# EasyEDA Pro project ProPrj_练手开发板_2024-08-21.epro, schematic t113_开发板

## Sheets
1 电源: Create Date: 2024-05-14; Page Name: 电源; Project Name: T113_开发板; Schematic Name: t113_开发板; Update Date: 2024-05-17; Company: 嘉立创EDA; Page Size: A4; Version: V1.0
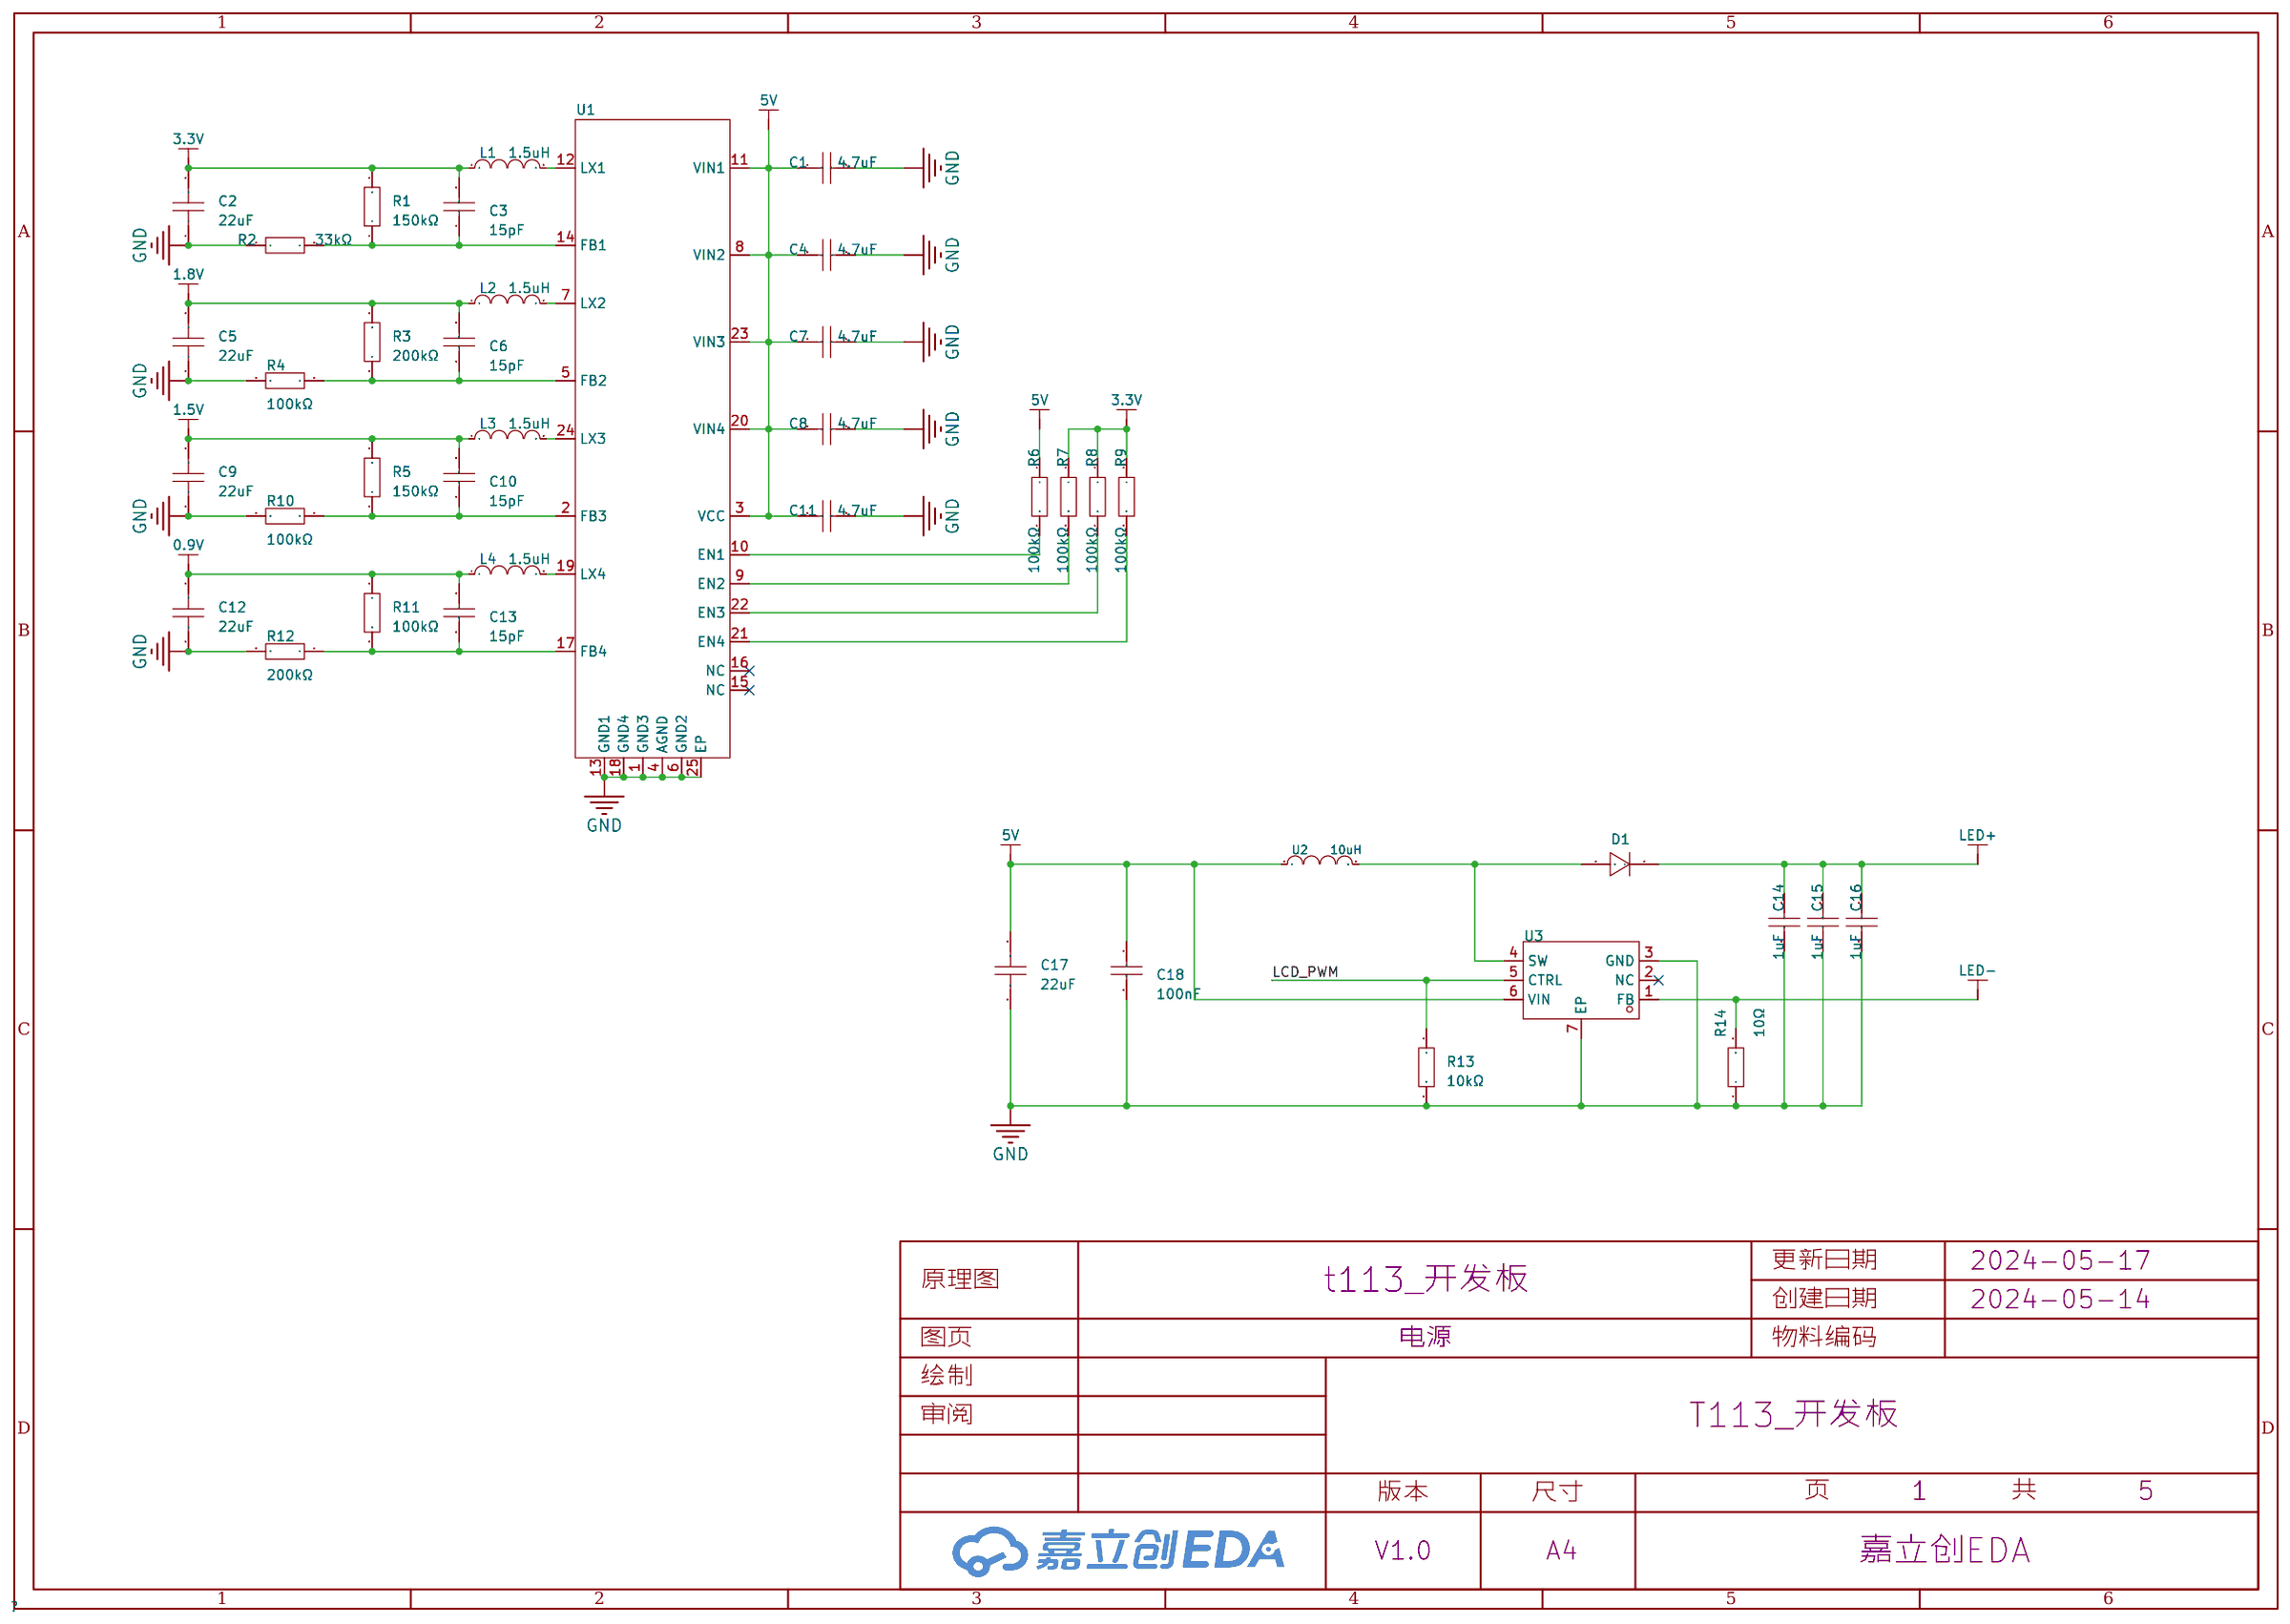
[diagram p0: 电源]
2 存储: Page Name: 存储; Update Date: 2024-05-14
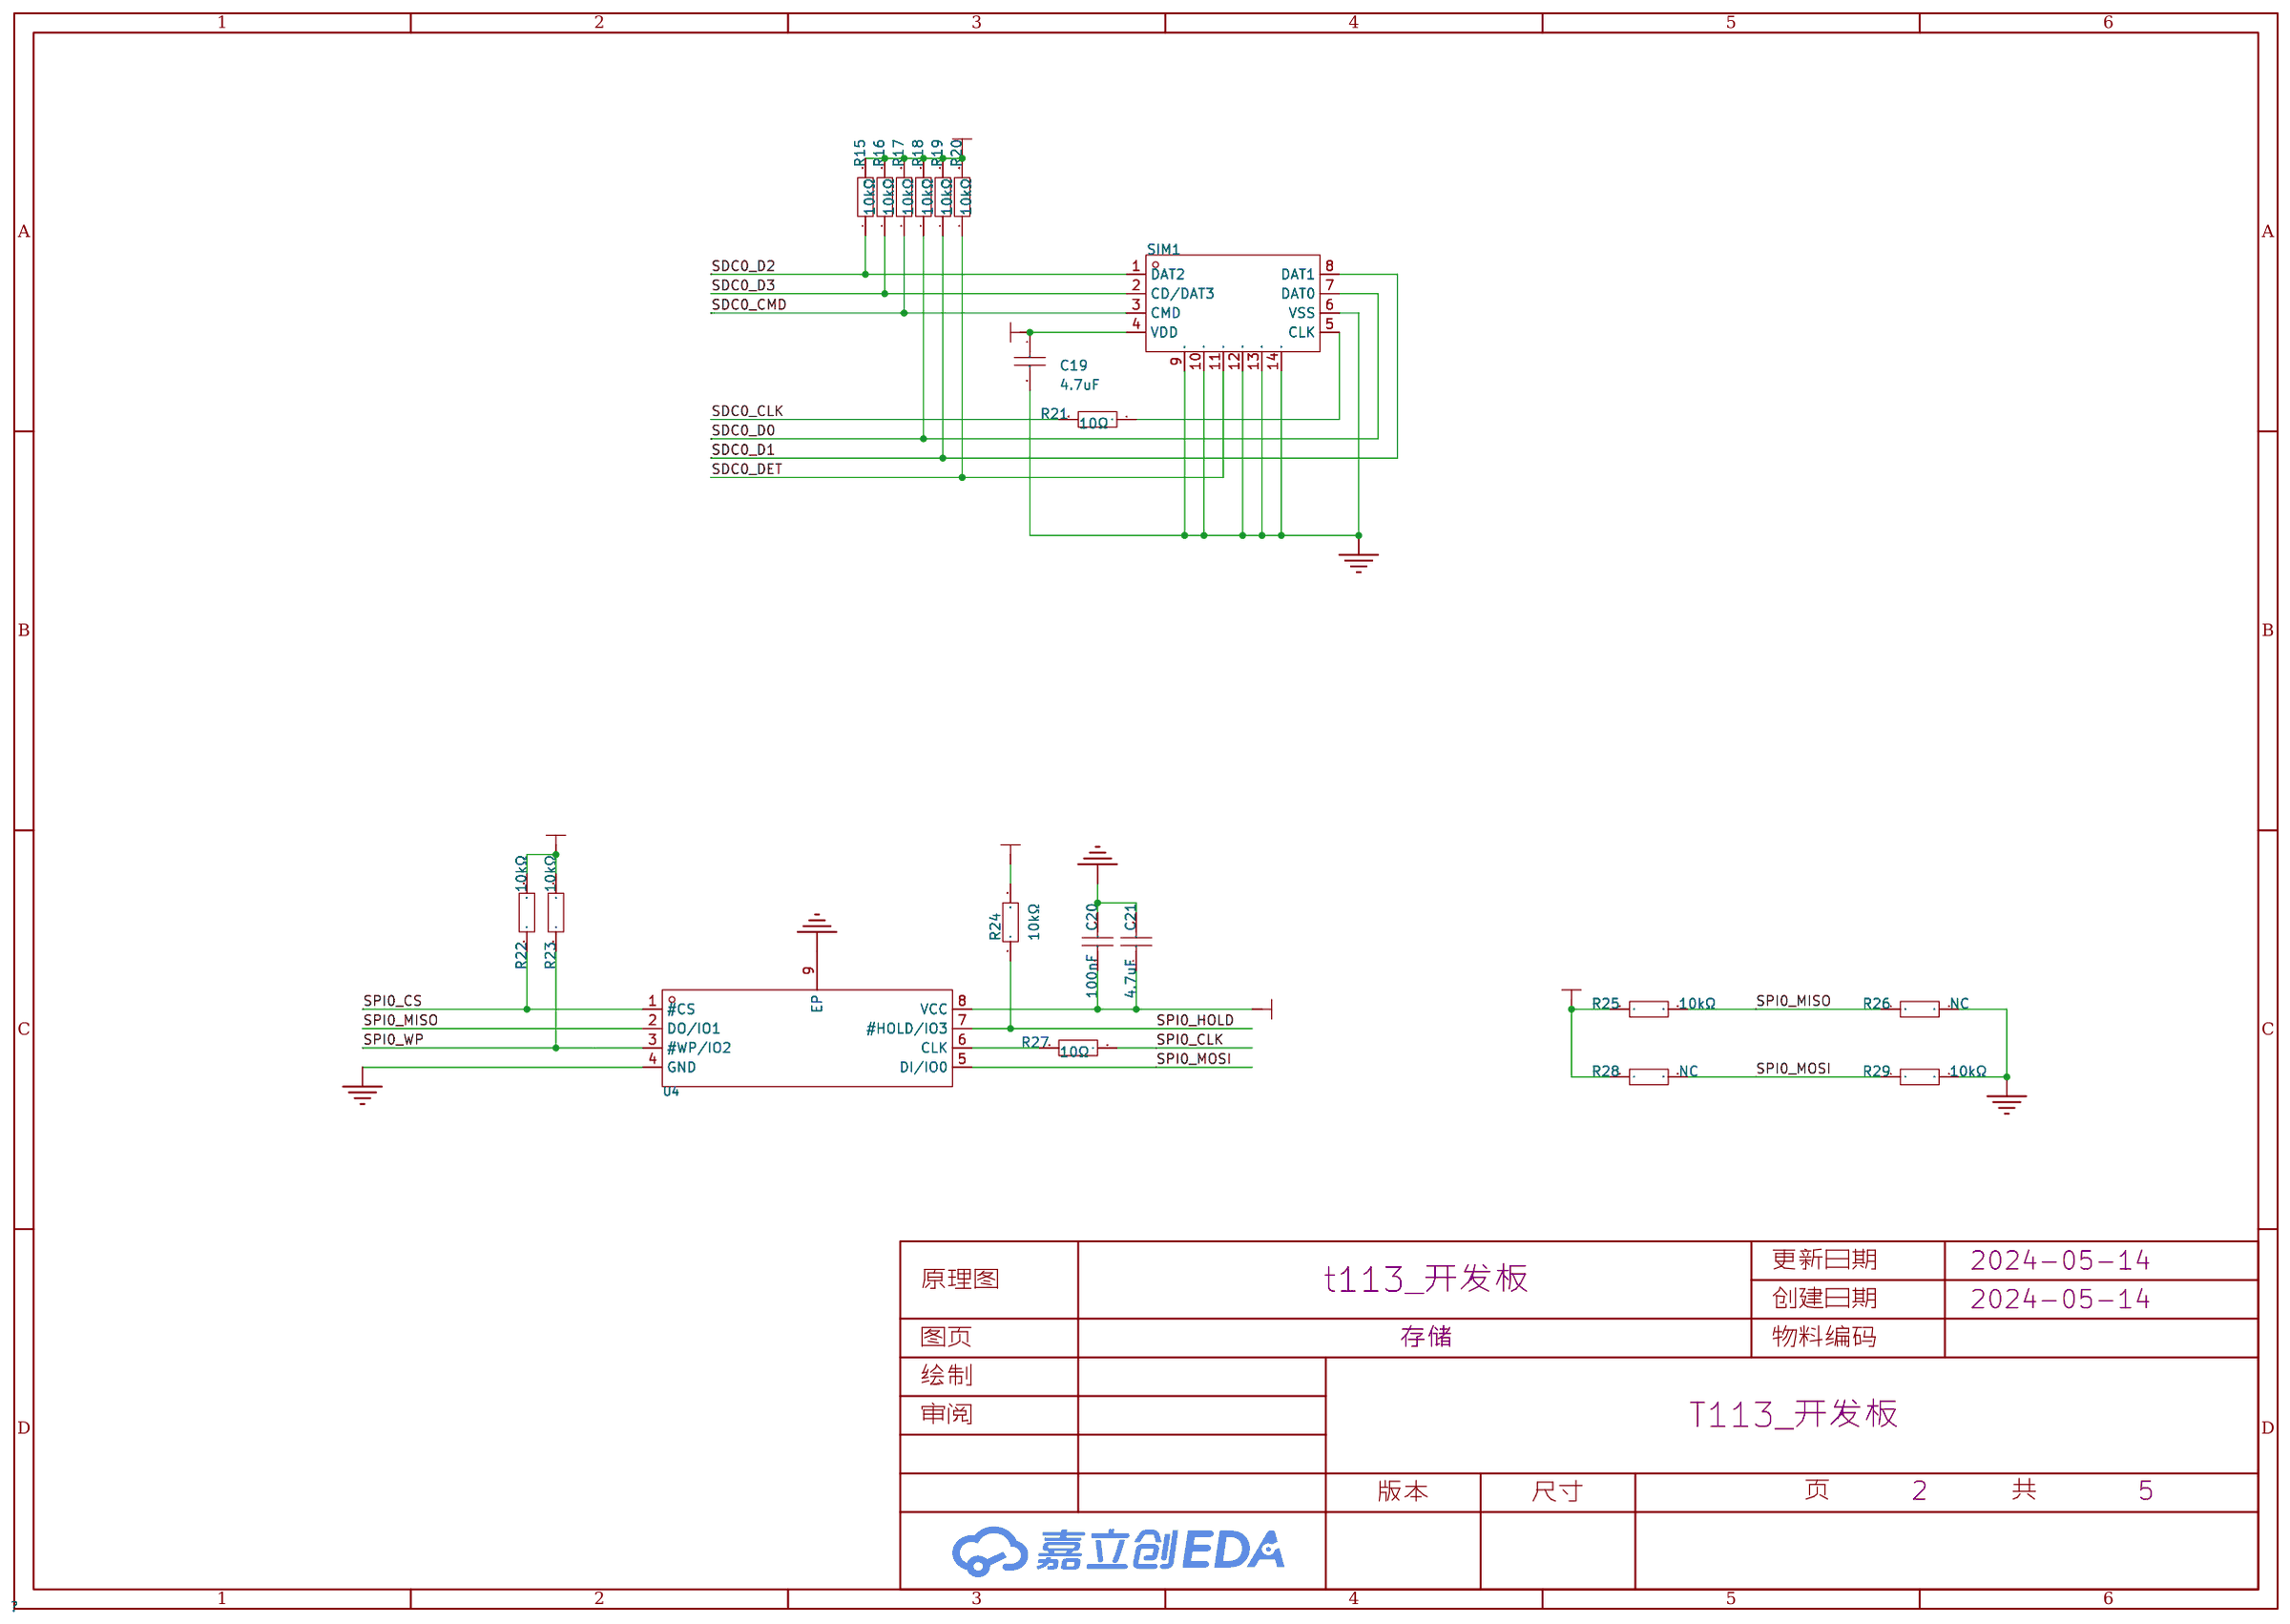
[diagram p1: 存储]
3 USB: Page Name: USB; Update Date: 2024-05-19
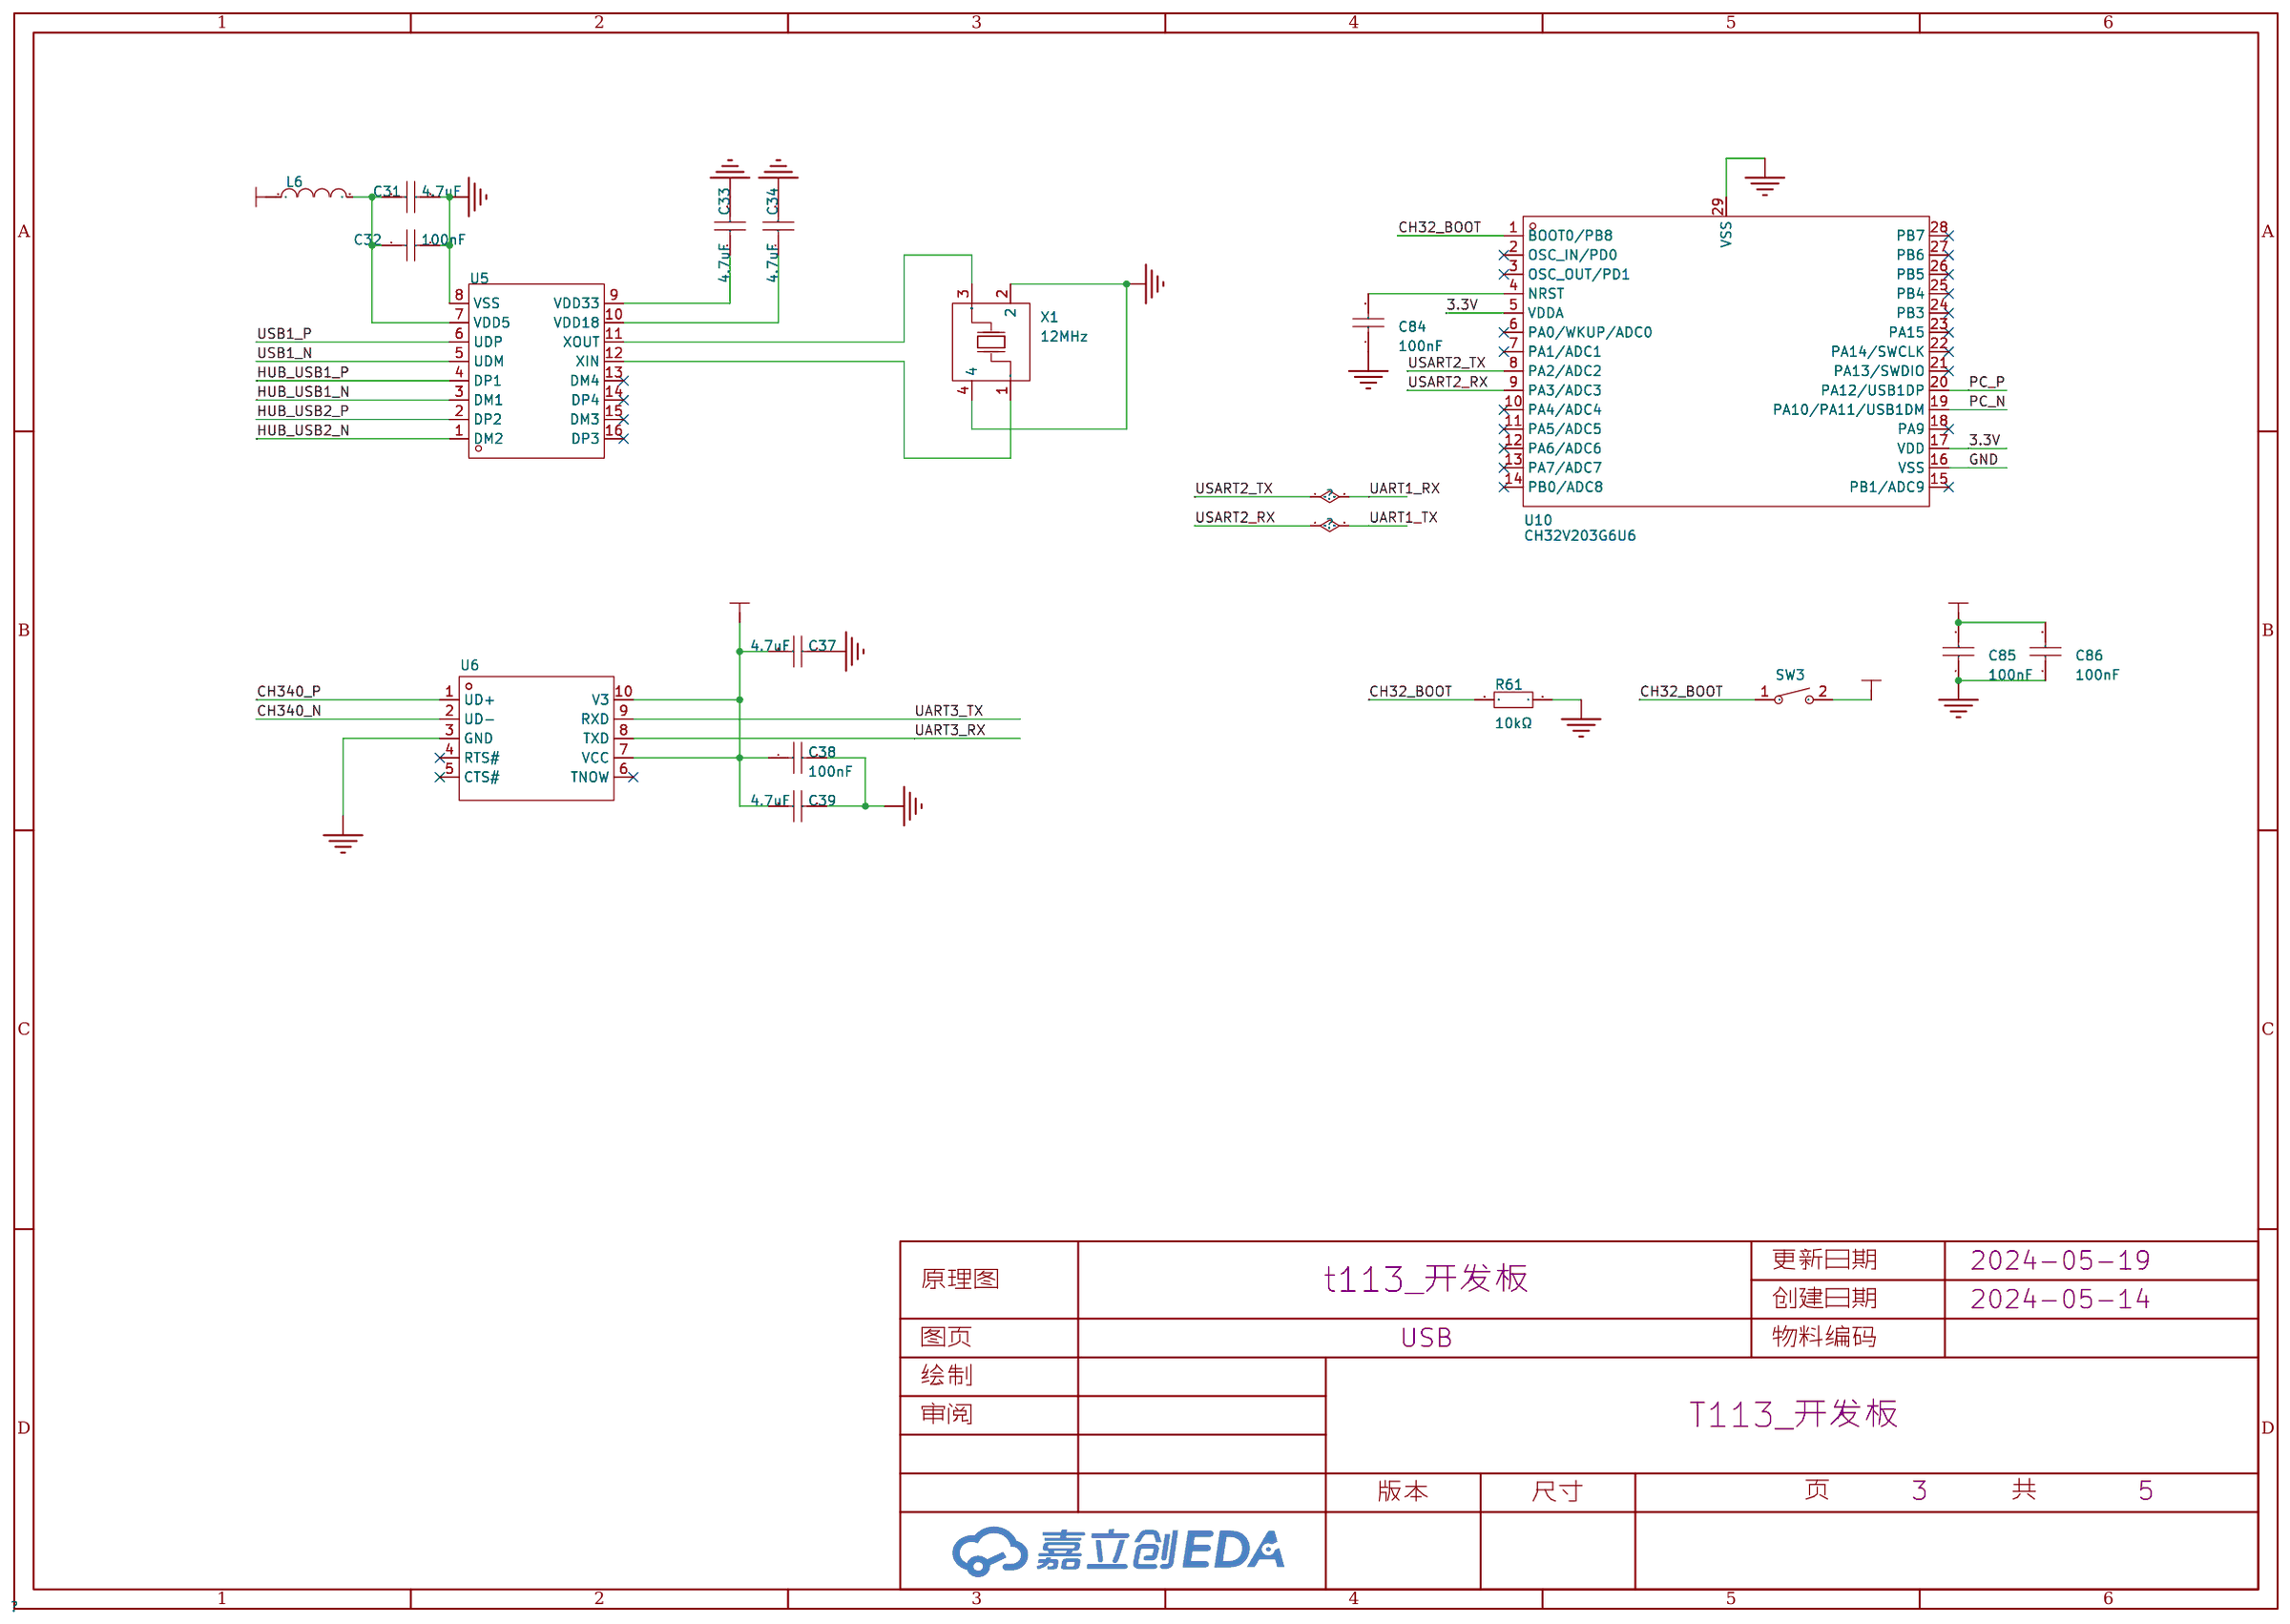
[diagram p2: USB]
4 接口: Page Name: 接口; Update Date: 2024-07-02
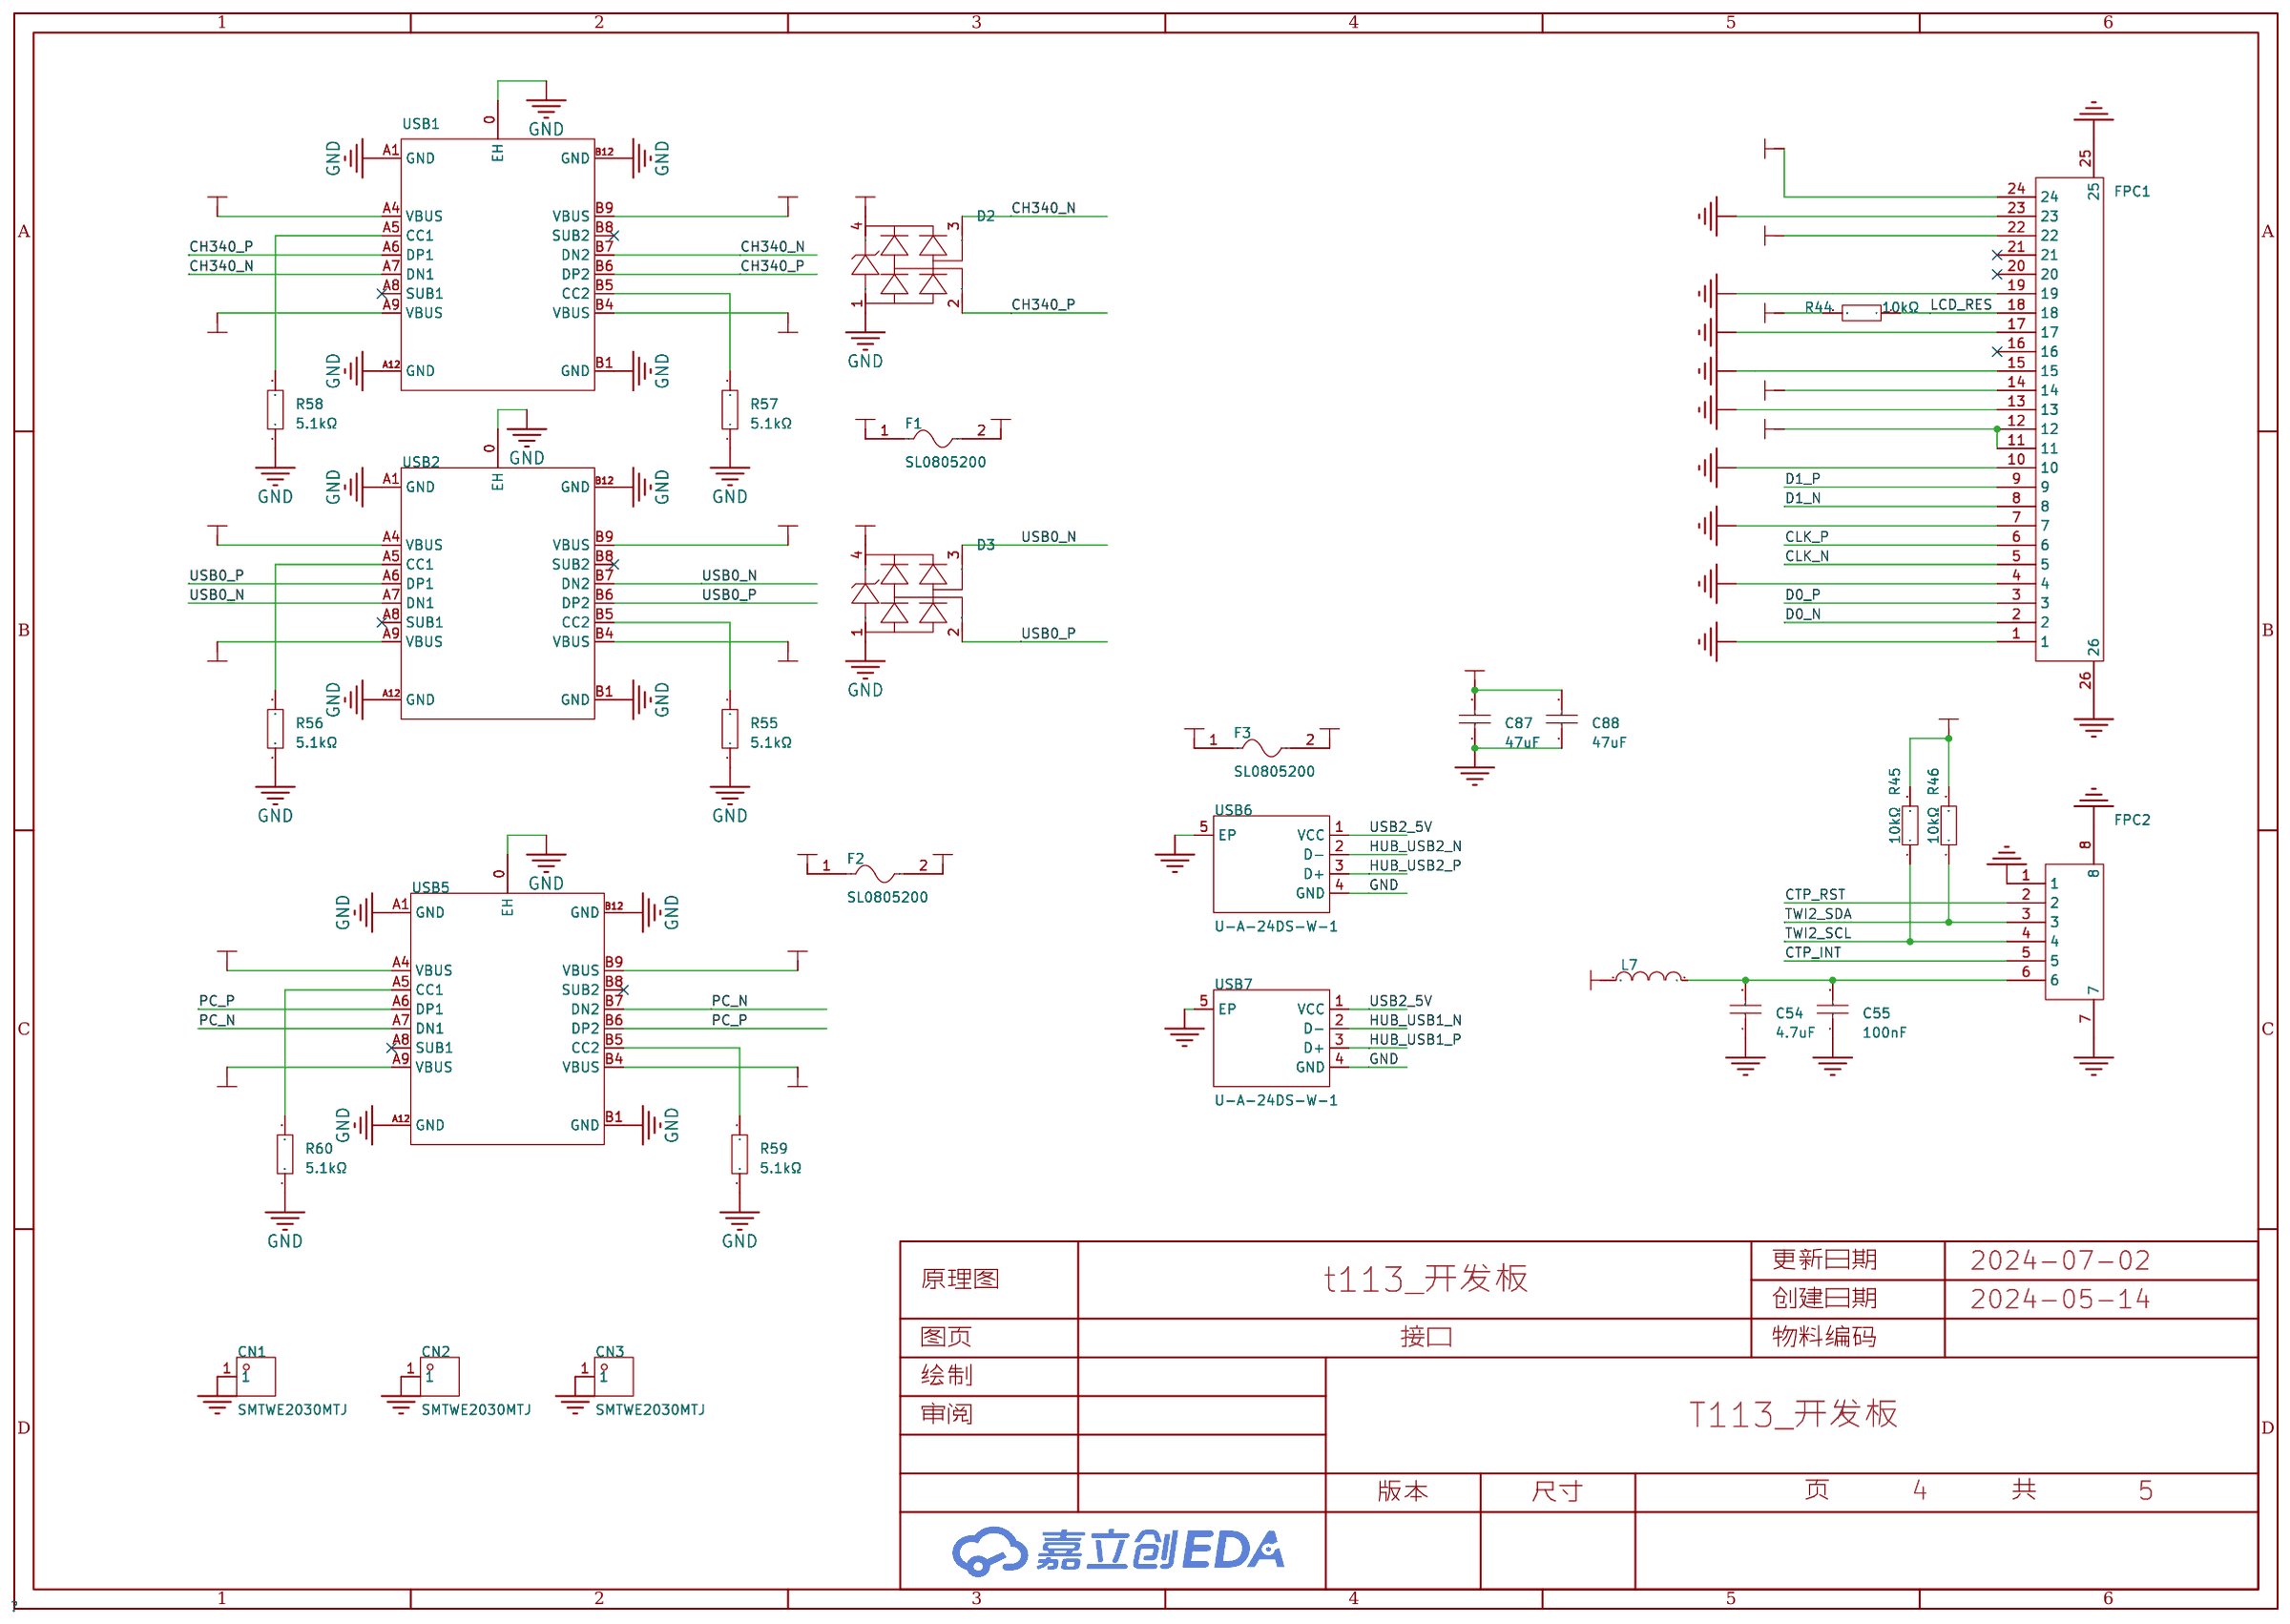
[diagram p3: 接口]
5 核心: Page Name: 核心; Update Date: 2024-05-18
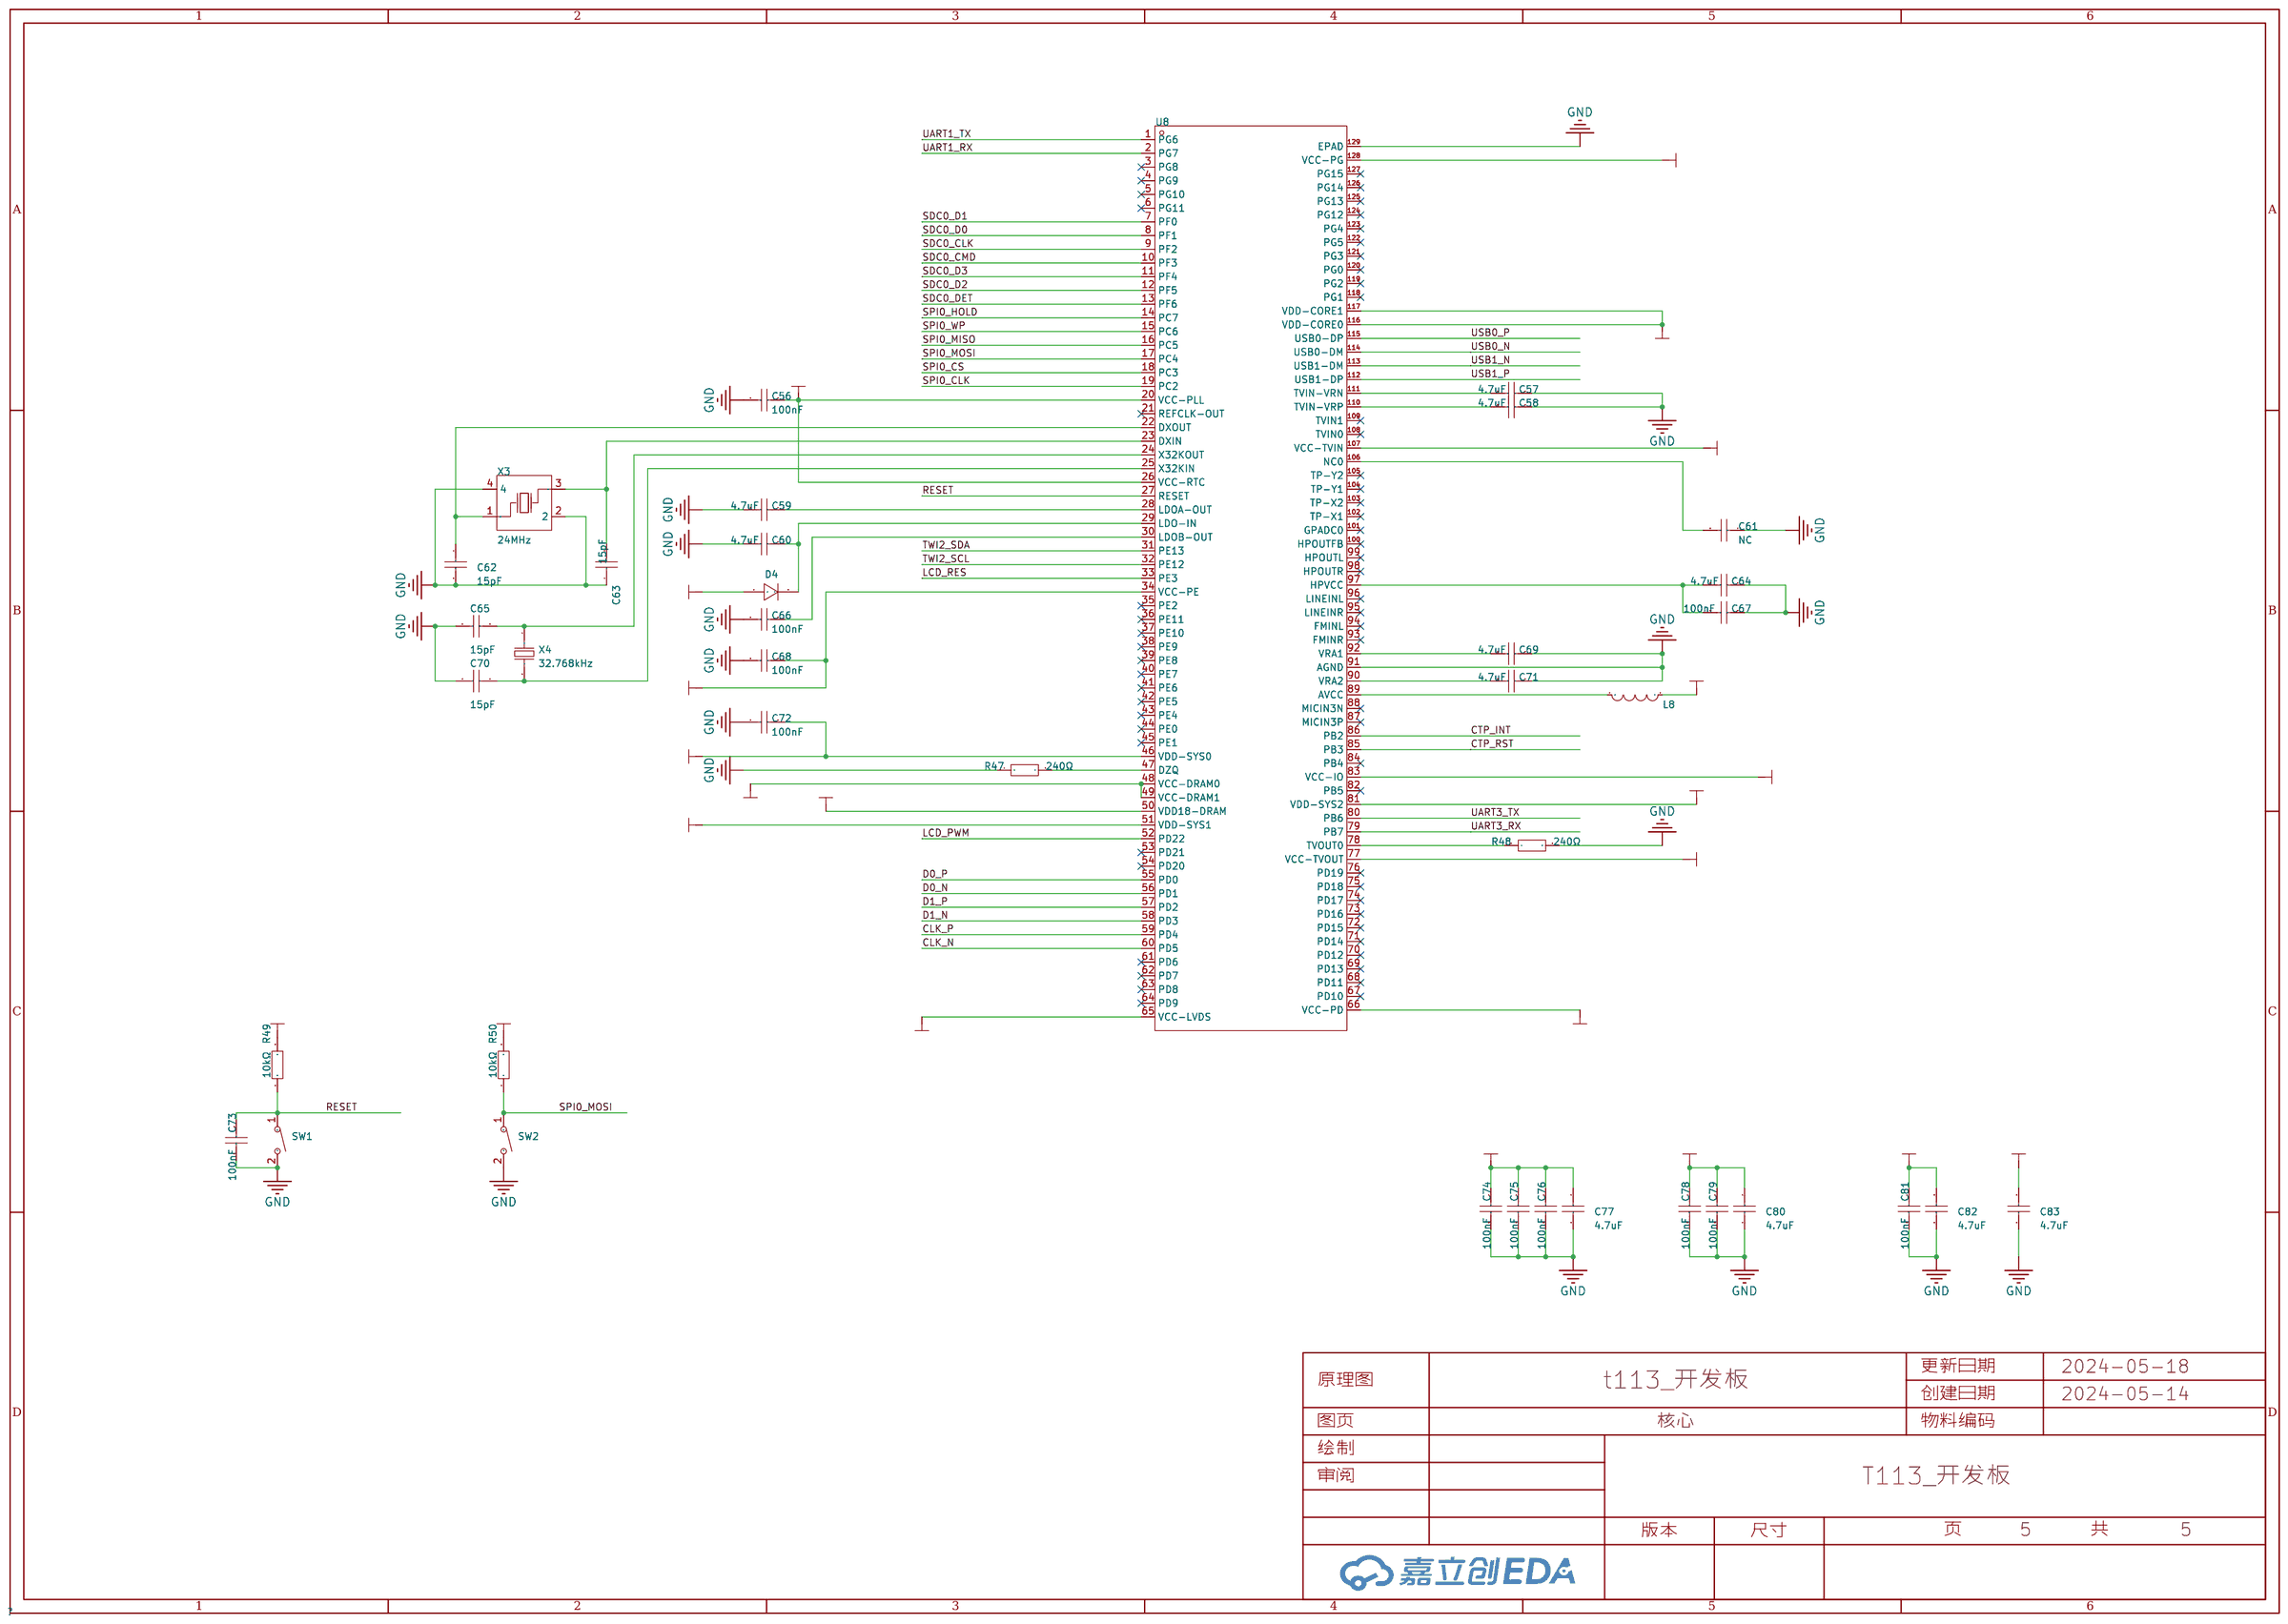
[diagram p4: 核心]

## Parts
sheet USB
C31  4.7uF  [C0402]
C32  100nF  [C0402]
C33  4.7uF  [C0402]
C34  4.7uF  [C0402]
C37  4.7uF  [C0402]
C38  100nF  [C0402]
C39  4.7uF  [C0402]
C84  100nF  [C0402]
C85  100nF  [C0402]
C86  100nF  [C0402]
L6  GZ1608D601TF  [L0603]
R61  10kΩ  [R0402]
SW3  TS342A2P-WZ  [SW-SMD_L4.0-W2.9-LS5.0]
U5  SL2.1s  [SSOP-16_L4.6-W2.6-P0.53-LS4.0-BL]
U6  CH340E  [MSOP-10_L3.0-W3.0-P0.50-LS5.0-BL]
U10  CH32V203G6U6  [QFN-28_L4.0-W4.0-P0.40-BL-EP2.7]
X1  12MHz  [OSC-SMD_4P-L2.5-W2.0-BL]
sheet 存储
C19  4.7uF  [C0402]
C20  100nF  [C0402]
C21  4.7uF  [C0402]
R15  10kΩ  [R0402]
R16  10kΩ  [R0402]
R17  10kΩ  [R0402]
R18  10kΩ  [R0402]
R19  10kΩ  [R0402]
R20  10kΩ  [R0402]
R21  10Ω  [R0402]
R22  10kΩ  [R0402]
R23  10kΩ  [R0402]
R24  10kΩ  [R0402]
R25  10kΩ  [R0402]
R26  NC  [R0402]
R27  10Ω  [R0402]
R28  NC  [R0402]
R29  10kΩ  [R0402]
SIM1  1040310811  [SIM-SMD_8P-1040310811]
U4  W25N01GVZEIG  [WSON-8_L8.0-W6.10-P1.27-TL-EP]
sheet 接口
C54  4.7uF  [C0402]
C55  100nF  [C0402]
C87  47uF  [C0805]
C88  47uF  [C0805]
CN1  SMTWE2030MTJ  [SMD-1_BD4.4-D2.8]
CN2  SMTWE2030MTJ  [SMD-1_BD4.4-D2.8]
CN3  SMTWE2030MTJ  [SMD-1_BD4.4-D2.8]
D2  PRTR5V0U2X  [SOT-143-4_L2.9-W1.3-P1.92-LS2.4-BL]
D3  PRTR5V0U2X  [SOT-143-4_L2.9-W1.3-P1.92-LS2.4-BL]
F1  SL0805200  [F0805]
F2  SL0805200  [F0805]
F3  SL0805200  [F0805]
FPC1  AFC01-S24FCA-00  [FPC-SMD_P0.50-24P_FGS-XJ-H2.0]
FPC2  AFC01-S06FCA-00  [FPC-SMD_P0.50-6P_AFC01-S06FCA-00]
L7  GZ1608D601TF  [L0603]
R44  10kΩ  [R0402]
R45  10kΩ  [R0402]
R46  10kΩ  [R0402]
R55  5.1kΩ  [R0402]
R56  5.1kΩ  [R0402]
R57  5.1kΩ  [R0402]
R58  5.1kΩ  [R0402]
R59  5.1kΩ  [R0402]
R60  5.1kΩ  [R0402]
USB1  TYPEC-304A-ACP16W  [USB-C_SMD-TYPE-C-31-M-12]
USB2  TYPEC-304A-ACP16W  [USB-C_SMD-TYPE-C-31-M-12]
USB5  TYPEC-304A-ACP16W  [USB-C_SMD-TYPE-C-31-M-12]
USB6  U-A-24DS-W-1  [USB-A-SMD_U-A-24DS-W-1.]
USB7  U-A-24DS-W-1  [USB-A-SMD_U-A-24DS-W-1.]
sheet 核心
C56  100nF  [C0402]
C57  4.7uF  [C0402]
C58  4.7uF  [C0402]
C59  4.7uF  [C0402]
C60  4.7uF  [C0402]
C61  NC  [C0402]
C62  15pF  [C0402]
C63  15pF  [C0402]
C64  4.7uF  [C0402]
C65  15pF  [C0402]
C66  100nF  [C0402]
C67  100nF  [C0402]
C68  100nF  [C0402]
C69  4.7uF  [C0402]
C70  15pF  [C0402]
C71  4.7uF  [C0402]
C72  100nF  [C0402]
C73  100nF  [C0402]
C74  100nF  [C0402]
C75  100nF  [C0402]
C76  100nF  [C0402]
C77  4.7uF  [C0402]
C78  100nF  [C0402]
C79  100nF  [C0402]
C80  4.7uF  [C0402]
C81  100nF  [C0402]
C82  4.7uF  [C0402]
C83  4.7uF  [C0402]
D4  DSS210  [SOD-123_L2.8-W1.8-LS3.7-FD]
L8  GZ1608D601TF  [L0603]
R47  240Ω  [R0402]
R48  240Ω  [R0402]
R49  10kΩ  [R0402]
R50  10kΩ  [R0402]
SW1  TS342A2P-WZ  [SW-SMD_L4.0-W2.9-LS5.0]
SW2  TS342A2P-WZ  [SW-SMD_L4.0-W2.9-LS5.0]
U8  T113-S3  [TQFP-128_L14.0-W14.0-P0.40-LS16.0-BL-EP6.4]
X3  24MHz  [CRYSTAL-SMD_4P-L2.5-W2.0-BL]
X4  32.768kHz  [FC-135R_L3.2-W1.5]
sheet 电源
C1  4.7uF  [C0402]
C2  22uF  [C0603]
C3  15pF  [C0402]
C4  4.7uF  [C0402]
C5  22uF  [C0603]
C6  15pF  [C0402]
C7  4.7uF  [C0402]
C8  4.7uF  [C0402]
C9  22uF  [C0603]
C10  15pF  [C0402]
C11  4.7uF  [C0402]
C12  22uF  [C0603]
C13  15pF  [C0402]
C14  1uF  [C0603]
C15  1uF  [C0603]
C16  1uF  [C0603]
C17  22uF  [C0603]
C18  100nF  [C0402]
D1  DSS210  [SOD-123_L2.8-W1.8-LS3.7-FD]
L1  1.5uH  [L0806]
L2  1.5uH  [L0806]
L3  1.5uH  [L0806]
L4  1.5uH  [L0806]
R1  150kΩ  [R0402]
R2  33kΩ  [R0402]
R3  200kΩ  [R0402]
R4  100kΩ  [R0402]
R5  150kΩ  [R0402]
R6  100kΩ  [R0402]
R7  100kΩ  [R0402]
R8  100kΩ  [R0402]
R9  100kΩ  [R0402]
R10  100kΩ  [R0402]
R11  100kΩ  [R0402]
R12  200kΩ  [R0402]
R13  10kΩ  [R0402]
R14  10Ω  [R0603]
U1  EA3059  [VQFN-24_L4.0-W4.0-P0.50-TL-EP2.5]
U2  10uH  [L0806]
U3  AW9962EDNR  [TDFN-6_L2.0-W2.0-P0.65-BL-EP]

## Library data of the parts
C1 C4 C7 C8 C11 C19 C21 C31 C33 C34 C37 C39 C54 C57-C60 C64 C69 C71 C77 C80 C82 C83 = CL05A475MP5NRNC: 容值:4.7uF;精度:±20%;额定电压:10V;材质(温度系数):X5R;; LCSC Part Name: 4.7uF ±20% 10V; Supplier Part: C23733; Manufacturer: SAMSUNG(三星); Supplier Footprint: 0402; JLCPCB Part Class: Basic Part; Datasheet: https://atta.szlcsc.com/upload/public/pdf/source/20160218/1457707763339.pdf; Supplier: LCSC; Tolerance: ±20%; Voltage Rated: 10V; Temperature Coefficient: X5R
C18 C20 C32 C38 C55 C56 C66-C68 C72-C76 C78 C79 C81 C84-C86 = CL05B104KB54PNC: 容值:100nF;精度:±10%;额定电压:50V;材质(温度系数):X7R;; LCSC Part Name: 100nF ±10% 50V; Supplier Part: C307331; Manufacturer: SAMSUNG(三星); Supplier Footprint: 0402; JLCPCB Part Class: Basic Part; Datasheet: https://atta.szlcsc.com/upload/public/pdf/source/20181009/C307331_222F7C870FD3EA5F46F538B483443886.pdf; Supplier: LCSC; Tolerance: ±10%; Voltage Rated: 50V; Temperature Coefficient: X7R
L6 L7 = GZ1608D601TF: 标称阻抗@测试频率:600Ω@100MHz;误差:±25%;直流电阻(RDC):450mΩ;; LCSC Part Name: 单路 0603磁珠 阻抗600Ω@100MHz; Supplier Part: C1002; Manufacturer: Sunlord(顺络); Supplier Footprint: 0603; JLCPCB Part Class: 基础库; Datasheet: https://atta.szlcsc.com/upload/public/pdf/source/20210830/355EA7C0FAC5394FC0FE3F17C770C20A.pdf; Supplier: LCSC; Impedance @ Frequency: 600Ω@100MHz; Tolerance: ±25%; DC Resistance: 450mΩ; Current Rating: 200mA; Circuits: 1
R13 R15-R20 R22-R25 R29 R44-R46 R49 R50 R61 = 0402WGF1002TCE: 阻值:10kΩ;精度:±1%;功率:62.5mW;温度系数:±100ppm/℃;电阻类型:厚膜电阻;; LCSC Part Name: 10kΩ ±1% 62.5mW 厚膜电阻; Supplier Part: C25744; Manufacturer: UNI-ROYAL(厚声); Supplier Footprint: 0402; JLCPCB Part Class: Basic Part; Datasheet: https://atta.szlcsc.com/upload/public/pdf/source/20200306/C422600_1E6D84923E4A46A82E41ADD87F860B5C.pdf; Supplier: LCSC; Tolerance: ±1%; Power(Watts): 62.5mW; Overload Voltage (Max): 50V; Temperature Coefficient: ±100ppm/℃; Type: 厚膜电阻; Operating Temperature Range: -55℃~+155℃
SW1-SW3 = TS342A2P-WZ: LCSC Part Name: 轻触开关 3*4*2 两脚小龟不带柱 250gf 黑色塑胶按钮; Supplier Part: C557591; Manufacturer: SHOU HAN(首韩); Supplier Footprint: SMD; JLCPCB Part Class: Extended Part; Datasheet: https://atta.szlcsc.com/upload/public/pdf/source/20200519/C557591_B3A5A21584733303F06306F18577DA8B.pdf; Supplier: LCSC
U5 = SL2.1s: 应用功能:集线器;接口协议:-;; Supplier Part: C2684433; Manufacturer: CoreChips(和芯润德); Supplier Footprint: SSOP-16-2.6mm; JLCPCB Part Class: 扩展库; Datasheet: https://atta.szlcsc.com/upload/public/pdf/source/20210326/C2684433_0308B0C984AD3FC6CBDA43F1CDB06B3F.pdf; Supplier: LCSC; Applications Function: 集线器
U6 = CH340E: 应用功能:收发器;接口协议:USB 2.0;数据速率:2Mbps;; LCSC Part Name: USB转串口芯片 CH340; Supplier Part: C99652; Manufacturer: WCH(南京沁恒); Supplier Footprint: MSOP-10; JLCPCB Part Class: 扩展库; Datasheet: https://atta.szlcsc.com/upload/public/pdf/source/20230530/6E401E9554E9F5311886CC8B3F89B62E.pdf; Supplier: LCSC; Applications Function: 收发器; Protocol: USB 2.0; Data Rate: 2Mbps; Supply Voltage: 3.3V；5V
U10 = CH32V203G6U6: CPU内核:RISC-V;GPIO端口数量:-;工作电压范围:-;CPU最大主频:-;程序存储器类型:-;应用领域:-;; Supplier Part: C5142280; Manufacturer: WCH(南京沁恒); Supplier Footprint: QFN28X4; JLCPCB Part Class: 扩展库; Datasheet: https://atta.szlcsc.com/upload/public/pdf/source/20230523/1B381532B53560847D0152FAE396CF1C.pdf; Supplier: LCSC; CPU Core: RISC-V
X1 = TXM12M0004252FBCEO00T: 频率:12MHz;负载电容:12pF;频率公差:±10ppm;; LCSC Part Name: 12MHz ±10ppm 12pF; Supplier Part: C284155; Manufacturer: YJX(雅晶鑫); Supplier Footprint: SMD2520-4P; JLCPCB Part Class: Extended Part; Datasheet: https://atta.szlcsc.com/upload/public/pdf/source/20180910/C284155_B9AC3CB548367C19CE747B551130DB15.pdf; Supplier: LCSC; Crystal Type: 贴片无源晶振; Load Capacitance: 12pF; Equivalent Series Resistance (ESR): 120Ω; Frequency Tolerance: ±10ppm; Frequency Stability: ±30ppm; Operating Temperature: -40℃~+85℃; Check: true
R21 R27 = 0402WGF100JTCE: 阻值:10Ω;精度:±1%;功率:62.5mW;温度系数:±200ppm/℃;电阻类型:厚膜电阻;; LCSC Part Name: 10Ω ±1% 62.5mW 厚膜电阻; Supplier Part: C25077; Manufacturer: UNI-ROYAL(厚声); Supplier Footprint: 0402; JLCPCB Part Class: Basic Part; Datasheet: https://atta.szlcsc.com/upload/public/pdf/source/20200306/C422600_1E6D84923E4A46A82E41ADD87F860B5C.pdf; Supplier: LCSC; Tolerance: ±1%; Power(Watts): 62.5mW; Overload Voltage (Max): 50V; Temperature Coefficient: ±200ppm/℃; Type: 厚膜电阻; Operating Temperature Range: -55℃~+155℃
R26 R28 = 0402WGF1002TCE: 阻值:10kΩ;精度:±1%;功率:62.5mW;温度系数:±100ppm/℃;电阻类型:厚膜电阻;; LCSC Part Name: 10kΩ ±1% 62.5mW 厚膜电阻; Supplier Part: C25744; Manufacturer: UNI-ROYAL(厚声); Supplier Footprint: 0402; JLCPCB Part Class: 基础库; Datasheet: https://atta.szlcsc.com/upload/public/pdf/source/20200306/C422600_1E6D84923E4A46A82E41ADD87F860B5C.pdf; Supplier: LCSC; Tolerance: ±1%; Power(Watts): 62.5mW; Overload Voltage (Max): 50V; Temperature Coefficient: ±100ppm/℃; Type: 厚膜电阻; Operating Temperature Range: -55℃~+155℃; Check: false
SIM1 = 1040310811: 卡连接方式:拔插式;卡类型:MicroSD卡(TF卡);连接器类型:卡座;本体最大高度:1.42mm;触头镀层:金;工作温度范围:-;; LCSC Part Name: 拔插式 MicroSD卡(TF卡) 卡座; Supplier Part: C585350; Manufacturer: MOLEX; Supplier Footprint: SMD; JLCPCB Part Class: 扩展库; Datasheet: https://atta.szlcsc.com/upload/public/pdf/source/20201117/C585350_D1F0B30BD23514449186B2E50ACE8BBF.pdf; Supplier: LCSC; Card Connection Mode: 拔插式; Card Type: MicroSD卡(TF卡); Connector Type: 卡座; Maximum Body Height: 1.42mm; Contact Plating: 金
U4 = W25N01GVZEIG_C88868: 1-Gbit(128M x 8bit)，SPI接口，工作电压：2.7V to 3.6V; Supplier Part: C88868; Manufacturer: WINBOND(华邦); Supplier Footprint: WSON-8-EP(6.1x8); JLCPCB Part Class: 扩展库; Datasheet: https://atta.szlcsc.com/upload/public/pdf/source/20180428/C88868_D3C946FD371B1278FED16ED9DB2A4B79.pdf; Supplier: LCSC
C87 C88 = CL21A476MQYNNNE: 容值:47uF;精度:±20%;额定电压:6.3V;材质(温度系数):X5R;; LCSC Part Name: 47uF ±20% 6.3V; Supplier Part: C16780; Manufacturer: SAMSUNG(三星); Supplier Footprint: 0805; JLCPCB Part Class: 基础库; Datasheet: https://atta.szlcsc.com/upload/public/pdf/source/20160218/1457707763339.pdf; Supplier: LCSC; Tolerance: ±20%; Voltage Rated: 6.3V; Temperature Coefficient: X5R
CN1-CN3 = SMTWE2030MTJ: M2x4.35xL3+1.4; LCSC Part Name: 雄和远景，电路板表贴圆螺母柱，M2X3，铁镀锡,1个; Supplier Part: C2928179; Manufacturer: Sinhoo(雄和远景); JLCPCB Part Class: 扩展库; Datasheet: https://atta.szlcsc.com/upload/public/pdf/source/20220427/398CDD0E6CDAEFB781E7E646FA66B469.pdf; Supplier: LCSC; surface treatment: 镀锡; Product Description: M2*4.35*3+1.4
D2 D3 = PRTR5V0U2X: Supplier Part: C2827688; Manufacturer: TECH PUBLIC(台舟); Supplier Footprint: SOT-143; JLCPCB Part Class: Extended Part; Datasheet: https://atta.szlcsc.com/upload/public/pdf/source/20210810/88897AC68D8E670F0742145AB5FD843C.pdf; Supplier: LCSC
F1-F3 = SL0805200: 最大电压:6V;最大电流:50A;保持电流:2A;跳闸电流:4A;; LCSC Part Name: 6V 2A 0805自恢复; Supplier Part: C70158; Manufacturer: 台湾陆海; Supplier Footprint: 0805; JLCPCB Part Class: 扩展库; Datasheet: https://atta.szlcsc.com/upload/public/pdf/source/20160823/1471947506254.pdf; Supplier: LCSC; Operating Voltage (Max): 6V; Current Rating (Max): 50A; Hold Current: 2A; Trip Current: 4A; Power Dissipation: 1W; Resistance - Initial (Ri) (Min): 8mΩ; Resistance - Post Trip (R1) (Max): 55mΩ; Maximum Time to Trip: 5s; Operating Temperature: -40℃~+70℃
FPC1 = AFC01-S24FCA-00: 锁定特性:翻盖式;触点类型:下接;触点数量:24P;间距:0.5mm;安装类型:卧贴;; LCSC Part Name: 间距:0.5mm P数:24P 翻盖式 下接; Supplier Part: C262669; Manufacturer: JS(钜硕电子); Supplier Footprint: SMD,P=0.5mm,卧贴; JLCPCB Part Class: Extended Part; Datasheet: https://atta.szlcsc.com/upload/public/pdf/source/20190816/C413942_2A72D1AC756EAE17EEDF756A339D4500.pdf; Supplier: LCSC; Locking Feature: 翻盖式; Contact Type: 下接; Number of Contacts: 24P; Pitch: 0.5mm; Mounting Type: 卧贴; FFC, FCB Thickness: 0.3mm; Height Above Board: 2mm
FPC2 = AFC01-S06FCA-00: 锁定特性:翻盖式;触点类型:下接;触点数量:6P;间距:0.5mm;安装类型:卧贴;; LCSC Part Name: 间距:0.5mm P数:6P 翻盖式 下接; Supplier Part: C262655; Manufacturer: JS(钜硕电子); Supplier Footprint: SMD,P=0.5mm,卧贴; JLCPCB Part Class: 扩展库; Datasheet: https://atta.szlcsc.com/upload/public/pdf/source/20190816/C413942_2A72D1AC756EAE17EEDF756A339D4500.pdf; Supplier: LCSC; Locking Feature: 翻盖式; Contact Type: 下接; Number of Contacts: 6P; Pitch: 0.5mm; Mounting Type: 卧贴; FFC, FCB Thickness: 0.3mm; Height Above Board: 2mm
R55-R60 = 0402WGF5101TCE: 电阻类型:厚膜电阻;阻值:5.1kΩ;精度:±1%;功率:62.5mW;最大工作电压:50V;温度系数:±100ppm/℃;; LCSC Part Name: 5.1kΩ ±1% 62.5mW 厚膜电阻; Supplier Part: C25905; Manufacturer: UNI-ROYAL(厚声); Supplier Footprint: 0402; JLCPCB Part Class: 基础库; Datasheet: https://atta.szlcsc.com/upload/public/pdf/source/20200306/C422600_1E6D84923E4A46A82E41ADD87F860B5C.pdf; Supplier: LCSC; Type: 厚膜电阻; Tolerance: ±1%; Power(Watts): 62.5mW; Overload Voltage (Max): 50V; Temperature Coefficient: ±100ppm/℃; Operating Temperature Range: -55℃~+155℃
USB1 USB2 USB5 = TYPEC-304A-ACP16W: 连接器类型:Type-C;标准:USB 3.1;公母:母座;触点数量:16;端口数量:1;安装方式:卧贴;额定电流 - 电源:5A;工作温度范围:-45~+85;焊接温度(最大值):260;; LCSC Part Name: Type-C 母座 卧贴; Supplier Part: C2909607; Manufacturer: XUNPU(讯普); Supplier Footprint: SMD,8.94x7.35x3.26mm; JLCPCB Part Class: Extended Part; Datasheet: https://atta.szlcsc.com/upload/public/pdf/source/20211029/5A76838C591B377E5BF09726BF37DE5A.pdf; Supplier: LCSC; Connector Type: Type-C; Standard: USB 3.1; Gender: 母座; Number of Contacts: 16; Number of Ports: 1; Mounting Style: 卧贴; Current Rating - Power (Max): 5A; Operating Temperature Range: -45~+85; Welding Temperature (Max): 260
USB6 USB7 = U-A-24DS-W-1: 连接器类型:Type-A;标准:USB 2.0;公母:母;端口数量:1;触点数量:4P;安装方式:沉板;额定电流 - 电源:1.5A;工作温度范围:-40℃~+85℃;; LCSC Part Name: Type-A 母 沉板; Supplier Part: C530628; Manufacturer: 韩国韩荣; Supplier Footprint: SMD; JLCPCB Part Class: 扩展库; Datasheet: https://atta.szlcsc.com/upload/public/pdf/source/20210810/2C067F99869714CFB9CFA9CD362C588E.pdf; Supplier: LCSC; Connector Type: Type-A; Standard: USB 2.0; Gender: 母; Number of Ports: 1; Number of Contacts: 4P; Mounting Style: 沉板; Current Rating - Power (Max): 1.5A; Operating Temperature Range: -40℃~+85℃
C61 = 0402CG150J500NT: 容值:15pF;精度:±5%;额定电压:50V;材质(温度系数):C0G;; LCSC Part Name: 15pF ±5% 50V; Supplier Part: C1548; Manufacturer: FH(风华); Supplier Footprint: 0402; JLCPCB Part Class: Basic Part; Datasheet: https://atta.szlcsc.com/upload/public/pdf/source/20200305/C486355_26A10D38EF8C2A5C37091D0039909270.pdf; Supplier: LCSC; Tolerance: ±5%; Voltage Rated: 50V; Temperature Coefficient: C0G; Check: false
C3 C6 C10 C13 C62 C63 C65 C70 = 0402CG150J500NT: 容值:15pF;精度:±5%;额定电压:50V;材质(温度系数):C0G;; LCSC Part Name: 15pF ±5% 50V; Supplier Part: C1548; Manufacturer: FH(风华); Supplier Footprint: 0402; JLCPCB Part Class: Basic Part; Datasheet: https://atta.szlcsc.com/upload/public/pdf/source/20200305/C486355_26A10D38EF8C2A5C37091D0039909270.pdf; Supplier: LCSC; Tolerance: ±5%; Voltage Rated: 50V; Temperature Coefficient: C0G
D1 D4 = DSS210_C511868: 正向压降(Vf):850mV@2A;直流反向耐压(Vr):100V;平均整流电流(Io):2A;; LCSC Part Name: 电压:100V 电流:2A; Supplier Part: C511868; Manufacturer: BORN(伯恩半导体); Supplier Footprint: SOD-123FL; JLCPCB Part Class: Extended Part; Datasheet: https://atta.szlcsc.com/upload/public/pdf/source/20230516/9F85296B942B21E2E4298CE8290C4B88.pdf; Supplier: LCSC; Forward Voltage (Vf@If): 850mV@2A; Reverse Voltage (Vr): 100V; Average Rectified Current (Io): 2A
L8 = GZ1608D601TF: 标称阻抗@测试频率:600Ω@100MHz;误差:±25%;直流电阻(RDC):450mΩ;; LCSC Part Name: 单路 0603磁珠 阻抗600Ω@100MHz; Supplier Part: C1002; Manufacturer: Sunlord(顺络); Supplier Footprint: 0603; JLCPCB Part Class: Basic Part; Datasheet: https://atta.szlcsc.com/upload/public/pdf/source/20210830/355EA7C0FAC5394FC0FE3F17C770C20A.pdf; Supplier: LCSC; Impedance @ Frequency: 600Ω@100MHz; Tolerance: ±25%; DC Resistance: 450mΩ; Current Rating: 200mA; Circuits: 1
R47 R48 = 0402WGF2400TCE: 阻值:240Ω;精度:±1%;功率:62.5mW;温度系数:±100ppm/℃;电阻类型:厚膜电阻;; LCSC Part Name: 240Ω ±1% 62.5mW 厚膜电阻; Supplier Part: C25094; Manufacturer: UNI-ROYAL(厚声); Supplier Footprint: 0402; JLCPCB Part Class: Extended Part; Datasheet: https://atta.szlcsc.com/upload/public/pdf/source/20200306/C422600_1E6D84923E4A46A82E41ADD87F860B5C.pdf; Supplier: LCSC; Tolerance: ±1%; Power(Watts): 62.5mW; Overload Voltage (Max): 50V; Temperature Coefficient: ±100ppm/℃; Type: 厚膜电阻; Operating Temperature Range: -55℃~+155℃
U8 = T113-S3: Supplier Part: C9900015916; Supplier Footprint: eQFP-128-0.4-P; JLCPCB Part Class: Extended Part; Datasheet: https://atta.szlcsc.comnull; Supplier: LCSC
X3 = TXM24M0004252BBCEO00T: 频率:24MHz;负载电容:8pF;频率公差:±10ppm;; LCSC Part Name: 24MHz ±10ppm 8pF; Supplier Part: C284163; Manufacturer: YJX(雅晶鑫); Supplier Footprint: SMD2520-4P; JLCPCB Part Class: 扩展库; Datasheet: https://atta.szlcsc.com/upload/public/pdf/source/20180910/C284163_C214A82BA5FBBC768836C34E36A09DA2.pdf; Supplier: LCSC; Crystal Type: 贴片无源晶振; Load Capacitance: 8pF; Equivalent Series Resistance (ESR): 55Ω; Frequency Tolerance: ±10ppm; Frequency Stability: ±30ppm; Operating Temperature: -40℃~+85℃
X4 = Q13FC1350000400: 晶振类型:贴片晶振;频率:32.768kHz;常温频差:±20ppm;外接负载电容:12.5pF;; LCSC Part Name: 32.768kHz ±20ppm 12.5pF; Supplier Part: C32346; Manufacturer: EPSON(爱普生); Manufacturer Part: Q13FC13500004; Supplier Footprint: SMD3215-2P; JLCPCB Part Class: Basic Part; Datasheet: https://atta.szlcsc.com/upload/public/pdf/source/20190108/C32346_746D6B07EAF90824457A96480007685F.pdf; Supplier: LCSC; Crystal Type: 贴片晶振; Frequency Tolerance: ±20ppm; Load Capacitance: 12.5pF; Equivalent Series Resistance (ESR): 70kΩ; Operating Temperature: -40℃~+85℃; Normal temperature Frequency Tolerance: ±20ppm; External load capacitor: 12.5pF
C2 C5 C9 C12 C17 = CL10A226MQ8NRNC: 容值:22uF;精度:±20%;额定电压:6.3V;材质(温度系数):X5R;; LCSC Part Name: 22uF ±20% 6.3V; Supplier Part: C59461; Manufacturer: SAMSUNG(三星); Supplier Footprint: 0603; JLCPCB Part Class: Basic Part; Datasheet: https://atta.szlcsc.com/upload/public/pdf/source/20160218/1457707763339.pdf; Supplier: LCSC; Tolerance: ±20%; Voltage Rated: 6.3V; Temperature Coefficient: X5R
C14-C16 = CL10A105KB8NNNC: 容值:1uF;精度:±10%;额定电压:50V;材质(温度系数):X5R;; LCSC Part Name: 1uF ±10% 50V; Supplier Part: C15849; Manufacturer: SAMSUNG(三星); Supplier Footprint: 0603; JLCPCB Part Class: Basic Part; Datasheet: https://atta.szlcsc.com/upload/public/pdf/source/20160218/1457707763339.pdf; Supplier: LCSC; Tolerance: ±10%; Voltage Rated: 50V; Temperature Coefficient: X5R
L1-L4 = TFM201610GHM-1R5MTAA: 电感值:1.5uH;精度:±20%;额定电流:2A;; LCSC Part Name: 1.5uH ±20% 2A 110mΩ; Supplier Part: C433056; Manufacturer: TDK; Supplier Footprint: 0806; JLCPCB Part Class: 扩展库; Datasheet: https://atta.szlcsc.com/upload/public/pdf/source/20190927/C433056_8B579287B33E42D9755106D4C40A7285.pdf; Supplier: LCSC; Tolerance: ±20%; Rated Current: 2A; DC Resistance (DCR): 110mΩ
R1 R5 = 0402WGF1503TCE: 阻值:150kΩ;精度:±1%;功率:62.5mW;温度系数:±100ppm/℃;电阻类型:厚膜电阻;; LCSC Part Name: 150kΩ ±1% 62.5mW 厚膜电阻; Supplier Part: C25755; Manufacturer: UNI-ROYAL(厚声); Supplier Footprint: 0402; JLCPCB Part Class: Extended Part; Datasheet: https://atta.szlcsc.com/upload/public/pdf/source/20200306/C422600_1E6D84923E4A46A82E41ADD87F860B5C.pdf; Supplier: LCSC; Tolerance: ±1%; Power(Watts): 62.5mW; Overload Voltage (Max): 50V; Temperature Coefficient: ±100ppm/℃; Type: 厚膜电阻; Operating Temperature Range: -55℃~+155℃
R2 = 0402WGF3302TCE: 阻值:33kΩ;精度:±1%;功率:62.5mW;温度系数:±100ppm/℃;电阻类型:厚膜电阻;; LCSC Part Name: 33kΩ ±1% 62.5mW 厚膜电阻; Supplier Part: C25779; Manufacturer: UNI-ROYAL(厚声); Supplier Footprint: 0402; JLCPCB Part Class: Basic Part; Datasheet: https://atta.szlcsc.com/upload/public/pdf/source/20200306/C422600_1E6D84923E4A46A82E41ADD87F860B5C.pdf; Supplier: LCSC; Tolerance: ±1%; Power(Watts): 62.5mW; Overload Voltage (Max): 50V; Temperature Coefficient: ±100ppm/℃; Type: 厚膜电阻; Operating Temperature Range: -55℃~+155℃
R3 R12 = 0402WGF2003TCE: 阻值:200kΩ;精度:±1%;功率:62.5mW;温度系数:±100ppm/℃;电阻类型:厚膜电阻;; LCSC Part Name: 200kΩ ±1% 62.5mW 厚膜电阻; Supplier Part: C25764; Manufacturer: UNI-ROYAL(厚声); Supplier Footprint: 0402; JLCPCB Part Class: Basic Part; Datasheet: https://atta.szlcsc.com/upload/public/pdf/source/20200306/C422600_1E6D84923E4A46A82E41ADD87F860B5C.pdf; Supplier: LCSC; Tolerance: ±1%; Power(Watts): 62.5mW; Overload Voltage (Max): 50V; Temperature Coefficient: ±100ppm/℃; Type: 厚膜电阻; Operating Temperature Range: -55℃~+155℃
R4 R6-R11 = 0402WGF1003TCE: 阻值:100kΩ;精度:±1%;功率:62.5mW;温度系数:±100ppm/℃;电阻类型:厚膜电阻;; LCSC Part Name: 100kΩ ±1% 62.5mW 厚膜电阻; Supplier Part: C25741; Manufacturer: UNI-ROYAL(厚声); Supplier Footprint: 0402; JLCPCB Part Class: Basic Part; Datasheet: https://atta.szlcsc.com/upload/public/pdf/source/20200306/C422600_1E6D84923E4A46A82E41ADD87F860B5C.pdf; Supplier: LCSC; Tolerance: ±1%; Power(Watts): 62.5mW; Overload Voltage (Max): 50V; Temperature Coefficient: ±100ppm/℃; Type: 厚膜电阻; Operating Temperature Range: -55℃~+155℃
R14 = 0603WAF100JT5E: 阻值:10Ω;精度:±1%;功率:100mW;温度系数:±400ppm/℃;电阻类型:厚膜电阻;; LCSC Part Name: 10Ω ±1% 100mW 厚膜电阻; Supplier Part: C22859; Manufacturer: UNI-ROYAL(厚声); Supplier Footprint: 0603; JLCPCB Part Class: Basic Part; Datasheet: https://atta.szlcsc.com/upload/public/pdf/source/20200306/C422600_1E6D84923E4A46A82E41ADD87F860B5C.pdf; Supplier: LCSC; Tolerance: ±1%; Power(Watts): 100mW; Overload Voltage (Max): 75V; Temperature Coefficient: ±400ppm/℃; Type: 厚膜电阻; Operating Temperature Range: -55℃~+155℃
U1 = EA3059: 电源电压:2.7V~5.5V;最大充电电流:-;电池类型:-;电池节数:4;; Supplier Part: C111586; Manufacturer: everanalog(申风); Supplier Footprint: QFN-24-EP(4x4); JLCPCB Part Class: Extended Part; Supplier: LCSC; Supply Voltage: 2.7V~5.5V; Number of Cells: 4; link: https://item.szlcsc.com/245167.html; 3DModel: QFN-24_L4.0-W4.0-H0.9-P0.50-; Check: true
U2 = DFE201610E-100M=P2: 电感值:10uH;精度:±20%;额定电流:1A;饱和电流(Isat):1A;; LCSC Part Name: 10uH ±20% 1A; Supplier Part: C426327; Manufacturer: muRata(村田); Supplier Footprint: 0806; JLCPCB Part Class: 扩展库; Datasheet: https://atta.szlcsc.com/upload/public/pdf/source/20190906/C426327_74A0375BC67DD5A78D5113DF30CDFE5F.pdf; Supplier: LCSC; Tolerance: ±20%; Rated Current: 1A; Saturation Current (Isat): 1A; DC Resistance (DCR): 780mΩ
U3 = AW9962EDNR: 类型:-;拓扑结构:-;通道数:-;输入电压:-;开关频率:-;输出电压:-;调光:-;特性:-;工作温度:-40℃~+85℃;; LCSC Part Name: 串联背光灯驱动; Supplier Part: C401004; Manufacturer: AWINIC(艾为); Supplier Footprint: TDFN-6-EP(2x2); JLCPCB Part Class: Extended Part; Datasheet: https://atta.szlcsc.com/upload/public/pdf/source/20190701/C401004_7AC10A0310DBEF22C0CD7B311D42065D.pdf; Supplier: LCSC; Operating temperature: -40℃~+85℃

## Nets
0.9V: C12.2 C13.2 C72.2 C78.1 C79.1 C80.2 L4.1 R11.1 U8.46(VDD-SYS0) U8.51(VDD-SYS1) U8.81(VDD-SYS2) U8.116(VDD-CORE0) U8.117(VDD-CORE1)
1.5V: C9.2 C10.2 C83.2 L3.1 R5.2 U8.48(VCC-DRAM0) U8.49(VCC-DRAM1)
1.8V: C5.2 C6.2 C56.2 C81.1 C82.2 L2.1 L8.1 R3.2 U8.20(VCC-PLL) U8.26(VCC-RTC) U8.50(VDD18-DRAM) U8.65(VCC-LVDS) U8.107(VCC-TVIN)
3.3V: C2.2 C3.2 C19.1 C20.1 C21.1 C37.2 C38.1 C39.2 C68.2 C74.1 C75.1 C76.1 C77.2 C85.2 C86.2 D4.1(A) FPC1.11 FPC1.12 FPC1.14 L1.1 L7.1 R1.2 R7.1 R8.1 R9.1 R15.2 R16.2 R17.2 R18.2 R19.2 R20.2 R22.2 R23.2 R24.2 R25.1 R28.1 R44.2 R45.2 R46.2 R49.2 R50.2 SIM1.4(VDD) SW3.2 U4.8(VCC) U6.7(VCC) U6.10(V3) U8.34(VCC-PE) U8.66(VCC-PD) U8.77(VCC-TVOUT) U8.83(VCC-IO) U8.128(VCC-PG) U10.5(VDDA) U10.17(VDD)
5V: C1.1 C4.1 C7.1 C8.1 C11.1 C17.2 C18.1 F1.2 F2.2 F3.1 L6.1 R6.1 U1.3(VCC) U1.8(VIN2) U1.11(VIN1) U1.20(VIN4) U1.23(VIN3) U2.1 U3.6(VIN)
GND: C1.2 C2.1 C4.2 C5.1 C7.2 C8.2 C9.1 C11.2 C12.1 C14.1 C15.1 C16.1 C17.1 C18.2 C19.2 C20.2 C21.2 C31.2 C32.2 C33.2 C34.2 C37.1 C38.2 C39.1 C54.1 C55.1 C56.1 C57.1 C58.1 C59.2 C60.2 C61.1 C62.2 C63.1 C64.1 C65.2 C66.1 C67.2 C68.1 C69.1 C70.2 C71.1 C72.1 C73.2 C74.2 C75.2 C76.2 C77.1 C78.2 C79.2 C80.1 C81.2 C82.1 C83.1 C84.1 C85.1 C86.1 C87.1 C88.1 CN1.1 CN2.1 CN3.1 D2.1 D3.1 FPC1.1 FPC1.4 FPC1.7 FPC1.10 FPC1.13 FPC1.15 FPC1.17 FPC1.19 FPC1.23 FPC1.25 FPC1.26 FPC2.1 FPC2.7 FPC2.8 R2.1 R4.2 R10.2 R12.2 R13.2 R14.1 R26.2 R29.2 R47.1 R48.2 R55.1 R56.1 R57.1 R58.1 R59.1 R60.1 R61.1 SIM1.6(VSS) SIM1.9 SIM1.10 SIM1.12 SIM1.13 SIM1.14 SW1.2 SW2.2 U1.1(GND3) U1.4(AGND) U1.6(GND2) U1.13(GND1) U1.18(GND4) U1.25(EP) U3.3(GND) U3.7(EP) U4.4(GND) U4.9(EP) U5.8(VSS) U6.3(GND) U8.91(AGND) U8.129(EPAD) U10.16(VSS) U10.29(VSS) USB1.0(EH) USB1.A1(GND) USB1.A12(GND) USB1.B1(GND) USB1.B12(GND) USB2.0(EH) USB2.A1(GND) USB2.A12(GND) USB2.B1(GND) USB2.B12(GND) USB5.0(EH) USB5.A1(GND) USB5.A12(GND) USB5.B1(GND) USB5.B12(GND) USB6.4(GND) USB6.5(EP) USB7.4(GND) USB7.5(EP) X1.2 X1.4 X3.2 X3.4
CH32_BOOT: R61.2 SW3.1 U10.1(BOOT0/PB8)
CH340_N: D2.3 U6.2(UD-) USB1.A7(DN1) USB1.B7(DN2)
CH340_P: D2.2 U6.1(UD+) USB1.A6(DP1) USB1.B6(DP2)
CLK_N: FPC1.5 U8.60(PD5)
CLK_P: FPC1.6 U8.59(PD4)
CTP_INT: FPC2.5 U8.86(PB2)
CTP_RST: FPC2.2 U8.85(PB3)
D0_N: FPC1.2 U8.56(PD1)
D0_P: FPC1.3 U8.55(PD0)
D1_N: FPC1.8 U8.58(PD3)
D1_P: FPC1.9 U8.57(PD2)
HUB_USB1_N: U5.3(DM1) USB7.2(D-)
HUB_USB1_P: U5.4(DP1) USB7.3(D+)
HUB_USB2_N: U5.1(DM2) USB6.2(D-)
HUB_USB2_P: U5.2(DP2) USB6.3(D+)
LCD_PWM: R13.1 U3.5(CTRL) U8.52(PD22)
LCD_RES: FPC1.18 R44.1 U8.33(PE3)
LED+: C14.2 C15.2 C16.2 D1.2(K) FPC1.24
LED-: FPC1.22 R14.2 U3.1(FB)
PC_N: U10.19(PA10/PA11/USB1DM) USB5.A7(DN1) USB5.B7(DN2)
PC_P: U10.20(PA12/USB1DP) USB5.A6(DP1) USB5.B6(DP2)
RESET: C73.1 R49.1 SW1.1 U8.27(RESET)
SDC0_CLK: R21.2 U8.9(PF2)
SDC0_CMD: R17.1 SIM1.3(CMD) U8.10(PF3)
SDC0_D0: R18.1 SIM1.7(DAT0) U8.8(PF1)
SDC0_D1: R19.1 SIM1.8(DAT1) U8.7(PF0)
SDC0_D2: R15.1 SIM1.1(DAT2) U8.12(PF5)
SDC0_D3: R16.1 SIM1.2(CD/DAT3) U8.11(PF4)
SDC0_DET: R20.1 SIM1.11 U8.13(PF6)
SPI0_CLK: R27.1 U8.19(PC2)
SPI0_CS: R22.1 U4.1(#CS) U8.18(PC3)
SPI0_HOLD: R24.1 U4.7(#HOLD/IO3) U8.14(PC7)
SPI0_MISO: R25.2 R26.1 U4.2(DO/IO1) U8.16(PC5)
SPI0_MOSI: R28.2 R29.1 R50.1 SW2.1 U4.5(DI/IO0) U8.17(PC4)
SPI0_WP: R23.1 U4.3(#WP/IO2) U8.15(PC6)
TWI2_SCL: FPC2.4 R45.1 U8.32(PE12)
TWI2_SDA: FPC2.3 R46.1 U8.31(PE13)
UART1_RX: U8.2(PG7) U10.8(PA2/ADC2)
UART1_TX: U8.1(PG6) U10.9(PA3/ADC3)
UART3_RX: U6.8(TXD) U8.79(PB7)
UART3_TX: U6.9(RXD) U8.80(PB6)
USB0_N: D3.3 U8.114(USB0-DM) USB2.A7(DN1) USB2.B7(DN2)
USB0_P: D3.2 U8.115(USB0-DP) USB2.A6(DP1) USB2.B6(DP2)
USB1_5V: F2.1 USB5.A4(VBUS) USB5.A9(VBUS) USB5.B4(VBUS) USB5.B9(VBUS)
USB1_N: U5.5(UDM) U8.113(USB1-DM)
USB1_P: U5.6(UDP) U8.112(USB1-DP)
USB2_5V: C87.2 C88.2 F3.2 USB6.1(VCC) USB7.1(VCC)
USB_5V: D2.4 D3.4 F1.1 USB1.A4(VBUS) USB1.A9(VBUS) USB1.B4(VBUS) USB1.B9(VBUS) USB2.A4(VBUS) USB2.A9(VBUS) USB2.B4(VBUS) USB2.B9(VBUS)
$1N988: L1.2 U1.12(LX1)
$1N1593: L2.2 U1.7(LX2)
$1N1596: L3.2 U1.24(LX3)
$1N1602: L4.2 U1.19(LX4)
$1N3179: R9.2 U1.21(EN4)
$1N3183: R8.2 U1.22(EN3)
$1N3187: R7.2 U1.9(EN2)
$1N3191: R6.2 U1.10(EN1)
$1N3433: C3.1 R1.1 R2.2 U1.14(FB1)
$1N3555: C13.1 R11.2 R12.1 U1.17(FB4)
$1N3564: C10.1 R5.1 R10.1 U1.2(FB3)
$1N3584: C6.1 R3.1 R4.1 U1.5(FB2)
$1N4672: D1.1(A) U2.2 U3.4(SW)
$2N2442: R27.2 U4.6(CLK)
$2N12486: R21.1 SIM1.5(CLK)
$4N700: C33.1 U5.9(VDD33)
$4N704: C34.1 U5.10(VDD18)
$4N1305: U5.11(XOUT) X1.3(OSC2)
$4N1318: U5.12(XIN) X1.1(OSC1)
$4N1950: C31.1 C32.1 L6.2 U5.7(VDD5)
$4N8389: C84.2 U10.4(NRST)
$6N461: C54.2 C55.2 FPC2.6 L7.2
$6N16088: R55.2 USB2.B5(CC2)
$6N16096: R56.2 USB2.A5(CC1)
$6N16224: R58.2 USB1.A5(CC1)
$6N16228: R57.2 USB1.B5(CC2)
$6N17360: R59.2 USB5.B5(CC2)
$6N17361: R60.2 USB5.A5(CC1)
$7N2651: C62.1 U8.22(DXOUT) X3.1(OSC1)
$7N2652: C63.2 U8.23(DXIN) X3.3(OSC2)
$7N2654: C65.1 U8.24(X32KOUT) X4.1
$7N2686: C66.2 U8.30(LDOB-OUT)
$7N2695: R47.2 U8.47(DZQ)
$7N2745: R48.1 U8.78(TVOUT0)
$7N2813: C70.1 U8.25(X32KIN) X4.2
$7N2862: C61.2 U8.106(NC0)
$7N2876: L8.2 U8.89(AVCC)
$7N4200: C60.1 D4.2(K) U8.29(LDO-IN)
$7N4281: C69.2 U8.92(VRA1)
$7N4286: C71.2 U8.90(VRA2)
$7N4343: C64.2 C67.1 U8.97(HPVCC)
$7N4463: C58.2 U8.110(TVIN-VRP)
$7N4468: C57.2 U8.111(TVIN-VRN)
$7N7429: C59.1 U8.28(LDOA-OUT)

Not connected (* = marked no-connect by the designer): FPC1 16* 20* 21*; U1 15(NC)* 16(NC)*; U3 2(NC)*; U5 13(DM4)* 14(DP4)* 15(DM3)* 16(DP3)*; U6 4(RTS#)* 5(CTS#)* 6(TNOW)*; U8 3(PG8)* 4(PG9)* 5(PG10)* 6(PG11)* 21(REFCLK-OUT)* 35(PE2)* 36(PE11)* 37(PE10)* 38(PE9)* 39(PE8)* 40(PE7)* 41(PE6)* 42(PE5)* 43(PE4)* 44(PE0)* 45(PE1)* 53(PD21)* 54(PD20)* 61(PD6)* 62(PD7)* 63(PD8)* 64(PD9)* 67(PD10)* 68(PD11)* 69(PD13)* 70(PD12)* 71(PD14)* 72(PD15)* 73(PD16)* 74(PD17)* 75(PD18)* 76(PD19)* 82(PB5)* 84(PB4)* 87(MICIN3P)* 88(MICIN3N)* 93(FMINR)* 94(FMINL)* 95(LINEINR)* 96(LINEINL)* 98(HPOUTR)* 99(HPOUTL)* 100(HPOUTFB)* 101(GPADC0)* 102(TP-X1)* 103(TP-X2)* 104(TP-Y1)* 105(TP-Y2)* 108(TVIN0)* 109(TVIN1)* 118(PG1)* 119(PG2)* 120(PG0)* 121(PG3)* 122(PG5)* 123(PG4)* 124(PG12)* 125(PG13)* 126(PG14)* 127(PG15)*; U10 2(OSC_IN/PD0)* 3(OSC_OUT/PD1)* 6(PA0/WKUP/ADC0)* 7(PA1/ADC1)* 10(PA4/ADC4)* 11(PA5/ADC5)* 12(PA6/ADC6)* 13(PA7/ADC7)* 14(PB0/ADC8)* 15(PB1/ADC9)* 18(PA9)* 21(PA13/SWDIO)* 22(PA14/SWCLK)* 23(PA15)* 24(PB3)* 25(PB4)* 26(PB5)* 27(PB6)* 28(PB7)*; USB1 A8(SUB1)* B8(SUB2)*; USB2 A8(SUB1)* B8(SUB2)*; USB5 A8(SUB1)* B8(SUB2)*
